# EAGLE schematic TCU (EAGLE 9.5.2)
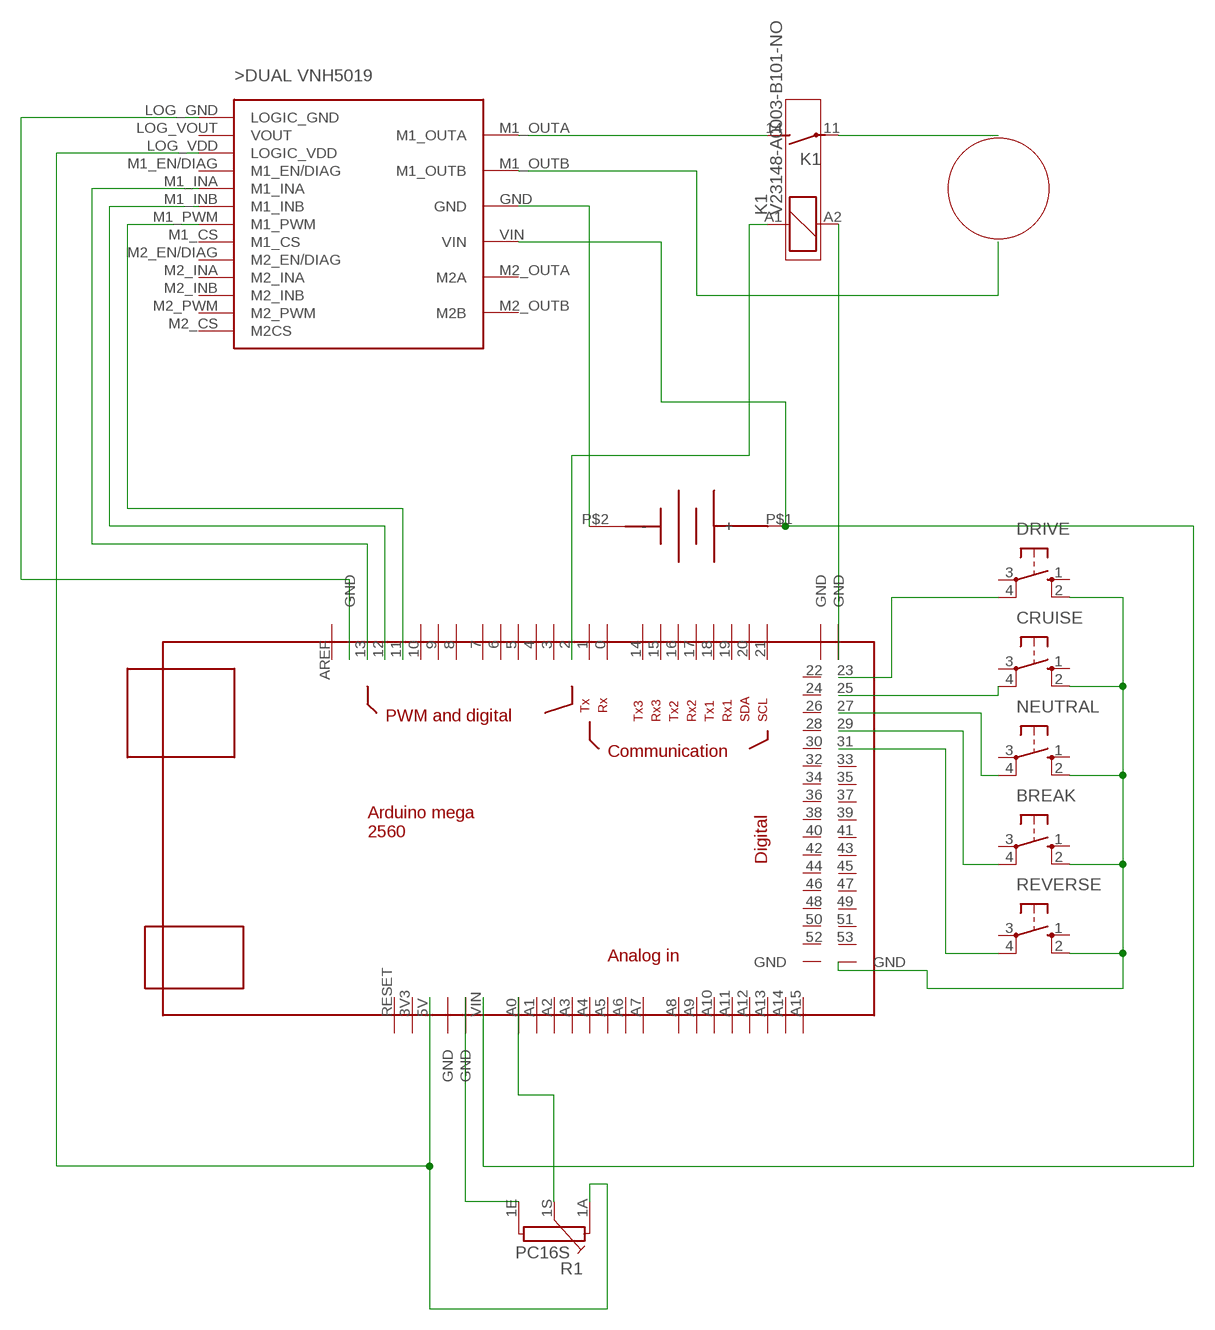
[diagram p0: schematic, sheet 1]

## Parts
BREAK  10-XX  [B3F-10XX]
CRUISE  10-XX  [B3F-10XX]
DRIVE  10-XX  [B3F-10XX]
DUAL_VNH1  DUAL_VNH5019  [DUAL_VNH5019]
K1  V23148-A0003-B101-NO  [V23148-NO]
NEUTRAL  10-XX  [B3F-10XX]
R1  PC16S  [PC16S]
REVERSE  10-XX  [B3F-10XX]
U$1  MEGA_DEVICE  [MEGABOX]
U$3  12V-BATTERY  [12V-BATTERY]

## Nets
N$1: DRIVE.4(P1) U$1.23
N$2: CRUISE.4(P1) U$1.25
N$3: NEUTRAL.4(P1) U$1.27
N$4: BREAK.4(P1) U$1.29
N$5: REVERSE.4(P1) U$1.31
N$6: BREAK.2(S1) CRUISE.2(S1) DRIVE.2(S1) NEUTRAL.2(S1) REVERSE.2(S1) U$1.GND@7(GND)
N$7: DUAL_VNH1.LOG_VDD(LOGIC_VDD) R1.1A U$1.5V
N$8: DUAL_VNH1.M1_OUTA K1.14(2:S)
N$9: DUAL_VNH1.LOG_GND(LOGIC_GND) U$1.GND@1(GND)
N$10: DUAL_VNH1.M1_INA U$1.13
N$11: DUAL_VNH1.GND U$3.P$2(-)
N$12: K1.11(2:P)
N$13: DUAL_VNH1.M1_OUTB
N$14: DUAL_VNH1.VIN U$1.VIN U$3.P$1(+)
N$16: R1.1E U$1.GND@3(GND)
N$17: R1.1S U$1.A0
N$18: K1.A1 U$1.2
N$19: K1.A2 U$1.GND@5(GND)
N$20: DUAL_VNH1.M1_INB U$1.12
N$21: DUAL_VNH1.M1_PWM U$1.11
Unconnected: BREAK.1(S) BREAK.3(P) CRUISE.1(S) CRUISE.3(P) DRIVE.1(S) DRIVE.3(P) DUAL_VNH1.LOG_VOUT(VOUT) DUAL_VNH1.M1_CS DUAL_VNH1.M1_EN/DIAG DUAL_VNH1.M2_CS(M2CS) DUAL_VNH1.M2_EN/DIAG DUAL_VNH1.M2_INA DUAL_VNH1.M2_INB DUAL_VNH1.M2_OUTA(M2A) DUAL_VNH1.M2_OUTB(M2B) DUAL_VNH1.M2_PWM NEUTRAL.1(S) NEUTRAL.3(P) REVERSE.1(S) REVERSE.3(P) U$1.0 U$1.1 U$1.3 U$1.3V3 U$1.4 U$1.5 U$1.6 U$1.7 U$1.8 U$1.9 U$1.10 U$1.14 U$1.15 U$1.16 U$1.17 U$1.18 U$1.19 U$1.20 U$1.21 U$1.22 U$1.24 U$1.26 U$1.28 U$1.30 U$1.32 U$1.33 U$1.34 U$1.35 U$1.36 U$1.37 U$1.38 U$1.39 U$1.40 U$1.41 U$1.42 U$1.43 U$1.44 U$1.45 U$1.46 U$1.47 U$1.48 U$1.49 U$1.50 U$1.51 U$1.52 U$1.53 U$1.A1 U$1.A2 U$1.A3 U$1.A4 U$1.A5 U$1.A6 U$1.A7 U$1.A8 U$1.A9 U$1.A10 U$1.A11 U$1.A12 U$1.A13 U$1.A14 U$1.A15 U$1.AREF U$1.GND@2(GND) U$1.GND@4(GND) U$1.GND@6(GND) U$1.RESET

## Library data of the parts
BREAK CRUISE DRIVE NEUTRAL REVERSE = switch-omron:10-XX: OMRON SWITCH; MPN: B3F-1000; OC_FARNELL: 176432; OC_NEWARK: 36M3542
DUAL_VNH1 = Self-Pololu:DUAL_VNH5019
K1 = relay:V23148-*-NO: Power PCB Relay U/UB normal open tyco/electronics; 1 pole 7 A, mono or bistabile www.schrackrelays.com/pdf/UUB.pdf; MPN: V23148-A0007-A101; OC_FARNELL: 1175042; OC_NEWARK: 48M9078
R1 = piher:PC16S: POTENTIOMETER single carbon potentiometer, 16 mm, S3ROH; OC_FARNELL: 4452940; OC_NEWARK: unknown
U$1 = ArduinoMegaSymbol:MEGA_DEVICE: mega card as device
U$3 = Auxilary:12V-BATTERY: 12V Lead Acid Battery Used To Power Aux Components